# EAGLE design RPI-Lora-Gateway-Shield (EAGLE 7.7.0)
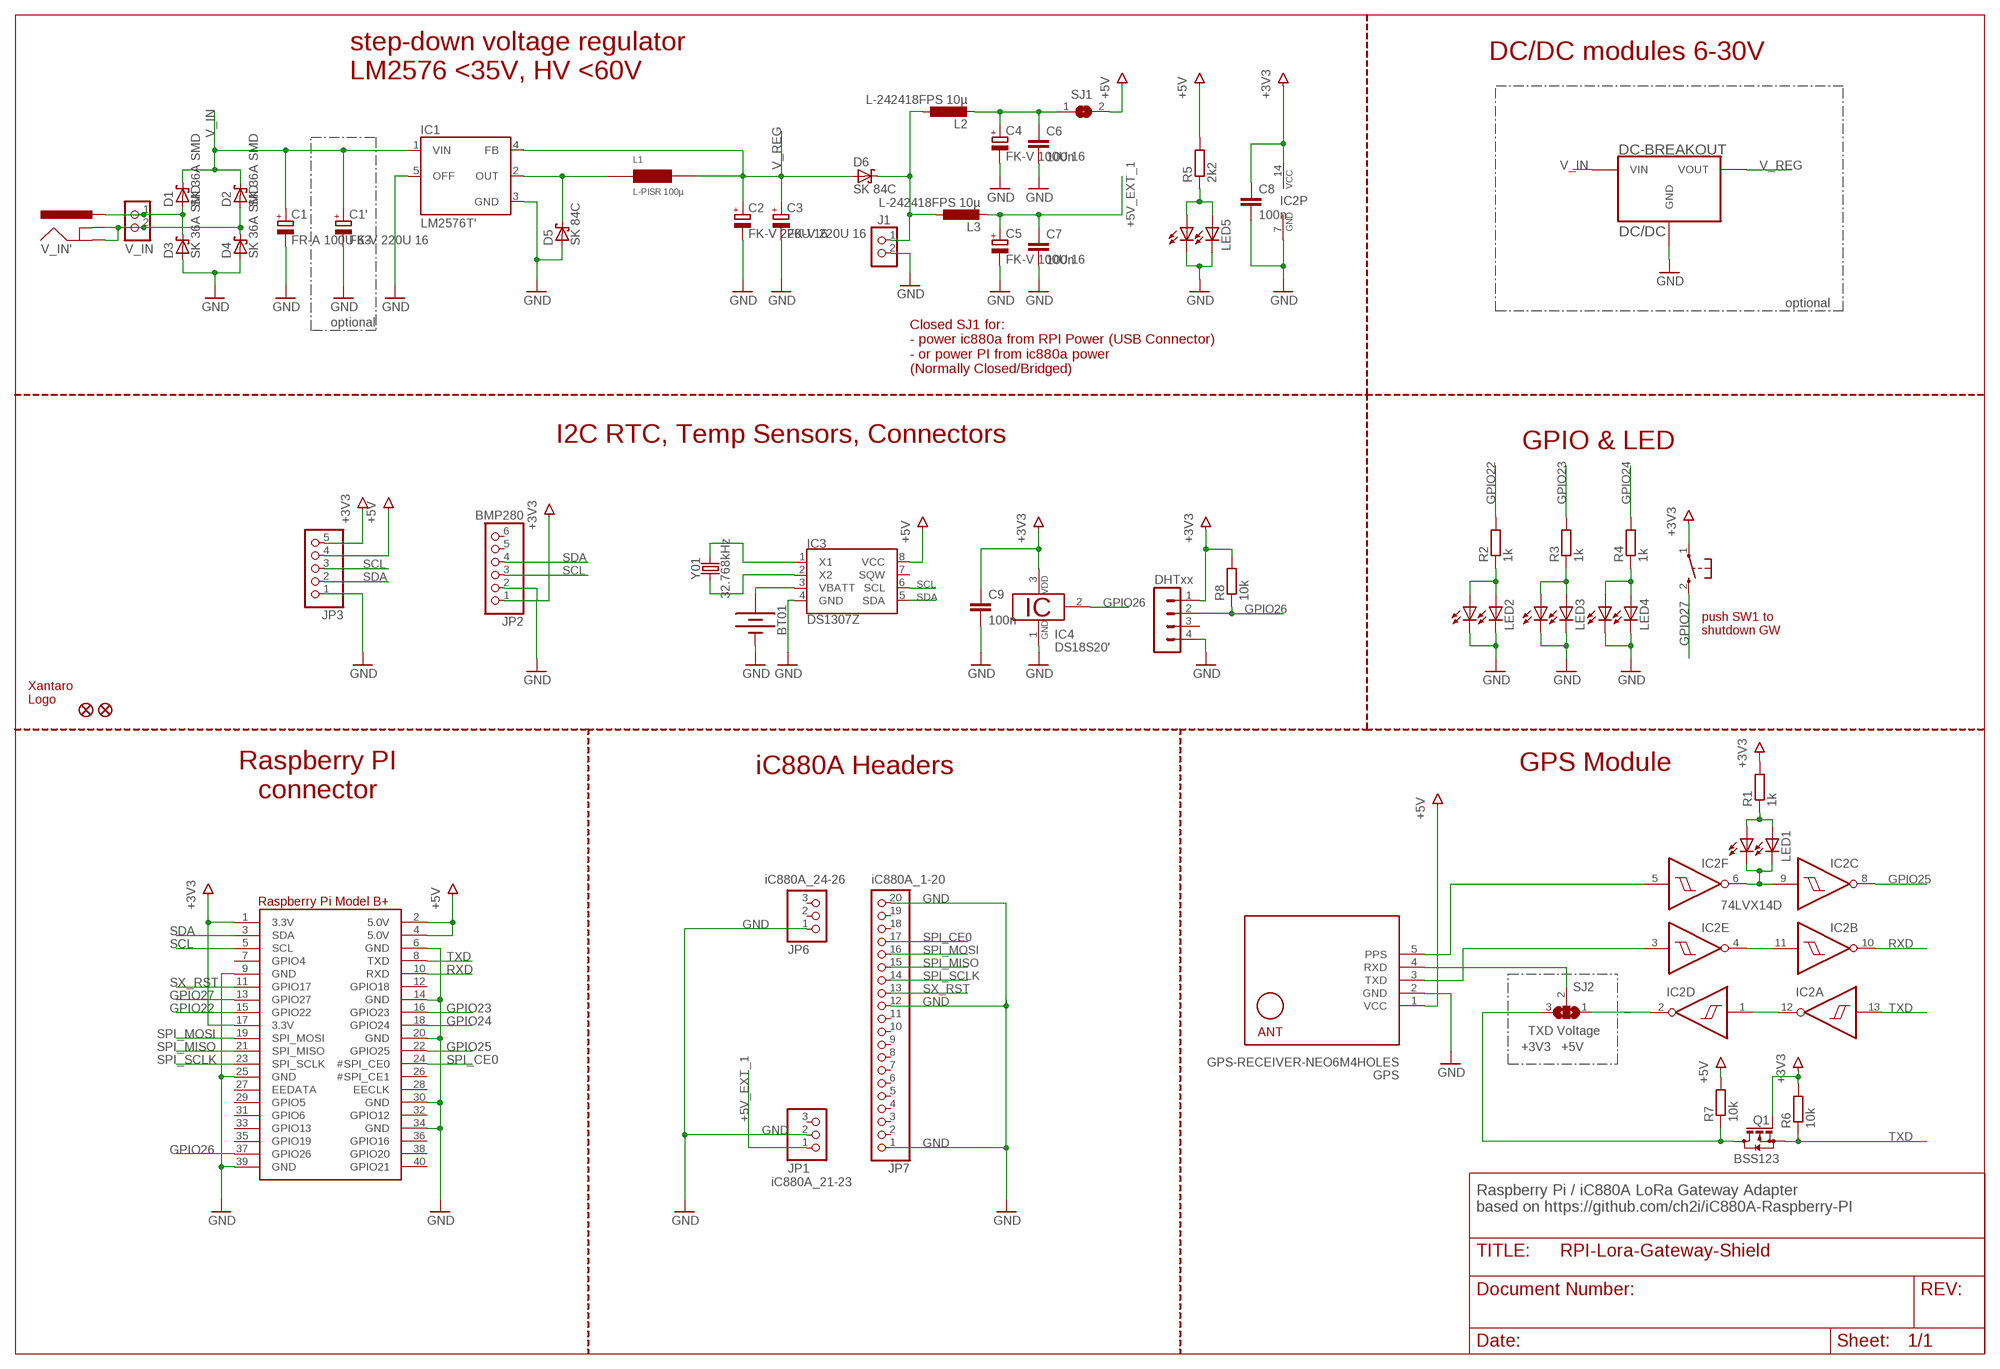
[diagram p0: schematic, sheet 1]

## Parts
BT01  BATTERY-12MM_PTH  [BATTCON_12MM_PTH]
C1  FR-A 100U 63  CPOL-EUE3.5-8  [E3,5-8]
C1'  FK-V 220U 16  CPOL-EUE  [PANASONIC_E]
C2  FK-V 220U 16  CPOL-EUE  [PANASONIC_E]
C3  FK-V 220U 16  CPOL-EUE  [PANASONIC_E]
C4  FK-V 100U 16  CPOL-EUD  [PANASONIC_D]
C5  FK-V 100U 16  CPOL-EUD  [PANASONIC_D]
C6  100n  C-EUC0805  [C0805]
C7  100n  C-EUC0805  [C0805]
C8  100n  C-EUC0805  [C0805]
C9  100n  C-EUC0805  [C0805]
D1  SK 36A SMD  SCHOTTKY-DIODESMD  [SMB]
D2  SK 36A SMD  SCHOTTKY-DIODESMD  [SMB]
D3  SK 36A SMD  SCHOTTKY-DIODESMD  [SMB]
D4  SK 36A SMD  SCHOTTKY-DIODESMD  [SMB]
D5  SK 84C  SCHOTTKY-DIODESMC  [SMC]
D6  SK 84C  SCHOTTKY-DIODESMC  [SMC]
DC/DC  DC-BREAKOUT  DC-BREAKOUTSTD  [DC-BREAKOUT]
FID2  FIDUCIAL""  [FIDUCIAL_1MM]
FID3  FIDUCIAL""  [FIDUCIAL_1MM]
GPS  GPS-RECEIVER-NEO6M4HOLES  [GPS-RECEIVER-NEO6M_4HOLES]
IC1  LM2576T'  [TO220-5_90]
IC2  74LVX14D  7414D  [SO14]
IC3  DS1307Z  [SO08-0.15]
IC4  DS18S20'  [TO92-2]
J1  +5V_IN  CON_TERMINAL_BLOCK_02-5MM  [TERMINAL_BLOCK_2P_5]
J5  DHTxx  CON_HEADER_1X04'NO_LOCK'  [1X04_NO_LOCK]
JP1  iC880A_21-23  PINHD-1X3  [1X03]
JP2  BMP280  PINHD-1X6  [1X06]
JP3  PINHD-1X5  [1X05]
JP6  iC880A_24-26  PINHD-1X3  [1X03]
JP7  iC880A_1-20  PINHD-1X20  [1X20]
L1  L-PISR 100µ  PISR  [PISR]
L2  L-242418FPS 10µ  L-EUL5650M  [L5650M]
L3  L-242418FPS 10µ  L-EUL5650M  [L5650M]
LED1  LEDCHIPLED_0805  [CHIPLED_0805]
LED1'  LED3MM  [LED3MM]
LED2  LEDCHIPLED_0805  [CHIPLED_0805]
LED2'  LED3MM  [LED3MM]
LED3  LEDCHIPLED_0805  [CHIPLED_0805]
LED3'  LED3MM  [LED3MM]
LED4  LEDCHIPLED_0805  [CHIPLED_0805]
LED4'  LED3MM  [LED3MM]
LED5  LEDCHIPLED_0805  [CHIPLED_0805]
LED5'  LED3MM  [LED3MM]
Q1  BSS123  [SOT23]
R1  1k  R-EU_R0805  [R0805]
R2  1k  R-EU_R0805  [R0805]
R3  1k  R-EU_R0805  [R0805]
R4  1k  R-EU_R0805  [R0805]
R5  2k2  R-EU_R0805  [R0805]
R6  10k  R-EU_R0805  [R0805]
R7  10k  R-EU_R0805  [R0805]
R8  10k  R-EU_R0805  [R0805]
RPI1  RASPBERRYPI_BPLUS_IDC  [2X20]
SJ1  SJCLOSED  [SJ_CLOSED]
SJ2  TXD Voltage  SJ2W  [SJ_2]
SW1'  RESET  KSS-2EG4430  [KSS-2EG4430]
U$4  XAN_LOGO_FULL_SILK_L  [XAN_FULL_SILK_L]
V_IN  V_IN  CON_TERMINAL_BLOCK_02-5MM  [TERMINAL_BLOCK_2P_5]
V_IN'  POWER_JACKPTH  [POWER_JACK_PTH]
Y01  32.768kHz  CRYSTAL-32.768KHZSMD-2X6  [CRYSTAL-SMD-2X6-CYL]

## Nets
+3V3: C8.1 C9.1 IC2.14(P:VCC) IC4.3 J5.1 JP2.1 JP3.5 Q1.1(G) R1.2 R6.2 R8.2 RPI1.1(3.3V) RPI1.17(3.3V) SW1'.1(P)
+5V: GPS.1(VCC) IC3.8(VCC) JP3.4 R5.2 R7.2 RPI1.2(5.0V) RPI1.4(5.0V) SJ1.2
+5V_EXT_1: C5.+ C7.1 JP1.1 L3.2
+5V_EXT_2: C4.+ C6.1 L2.2 SJ1.1
GND: BT01.2(-) C1'.- C1.- C2.- C3.- C4.- C5.- C6.2 C7.2 C8.2 C9.2 D3.A D4.A D5.A DC/DC.GND-1(GND) DC/DC.GND-2(GND) DC/DC.GND-3(GND) DC/DC.GND-4(GND) GPS.2(GND) IC1.3(GND) IC1.5(OFF) IC2.7(P:GND) IC3.4(GND) IC4.1 J1.2 J5.4 JP1.2 JP2.2 JP3.1 JP6.1 JP7.1 JP7.12 JP7.20 LED2'.K(C) LED2.C LED3'.K(C) LED3.C LED4'.K(C) LED4.C LED5'.K(C) LED5.C RPI1.6(GND) RPI1.9(GND) RPI1.14(GND) RPI1.20(GND) RPI1.25(GND) RPI1.30(GND) RPI1.34(GND) RPI1.39(GND)
GPIO22: R2.2 RPI1.15(GPIO22)
GPIO23: R3.2 RPI1.16(GPIO23)
GPIO24: R4.2 RPI1.18(GPIO24)
GPIO25: IC2.8(C:O) RPI1.22(GPIO25)
GPIO26: IC4.2 J5.2 R8.1 RPI1.37(GPIO26)
GPIO27: RPI1.13(GPIO27) SW1'.2(S)
N$14: D1.A D3.C V_IN'.PWR V_IN.1
N$16: LED1'.A LED1.A R1.1
N$18: IC2.1(D:I) IC2.12(A:O)
N$27: D6.C J1.1 L2.1 L3.1
N$28: D2.A D4.C V_IN'.GND V_IN'.GNDBREAK V_IN.2
N$29: GPS.5(PPS) IC2.5(F:I)
N$30: IC2.6(F:O) IC2.9(C:I) LED1'.K(C) LED1.C
N$31: GPS.3(TXD) IC2.3(E:I)
N$32: IC2.4(E:O) IC2.11(B:I)
N$34: GPS.4(RXD) SJ2.2
N$35: IC2.2(D:O) SJ2.1
N$36: D5.C IC1.2(OUT) L1.1
N$37: BT01.1(+) IC3.3(VBATT)
N$38: IC3.2(X2) Y01.X1
N$39: IC3.1(X1) Y01.X2
N$40: LED5'.A LED5.A R5.1
N$41: LED3'.A LED3.A R3.1
N$43: LED4'.A LED4.A R4.1
N$44: Q1.3(D) R7.1 SJ2.3
N$45: LED2'.A LED2.A R2.1
RXD: IC2.10(B:O) RPI1.10(RXD)
SCL: IC3.6(SCL) JP2.3 JP3.3 RPI1.5(SCL)
SDA: IC3.5(SDA) JP2.4 JP3.2 RPI1.3(SDA)
SPI_CE0: JP7.17 RPI1.24(#SPI_CE0)
SPI_MISO: JP7.15 RPI1.21(SPI_MISO)
SPI_MOSI: JP7.16 RPI1.19(SPI_MOSI)
SPI_SCLK: JP7.14 RPI1.23(SPI_SCLK)
SX_RST: JP7.13 RPI1.11(GPIO17)
TXD: IC2.13(A:I) Q1.2(S) R6.1 RPI1.8(TXD)
V_IN: C1'.+ C1.+ D1.C D2.C DC/DC.VIN-1(VIN) DC/DC.VIN-2(VIN) IC1.1(VIN)
V_REG: C2.+ C3.+ D6.A DC/DC.VOUT-1(VOUT) DC/DC.VOUT-2(VOUT) IC1.4(FB) L1.2
Unconnected: IC3.7(SQW) J5.3 JP1.3 JP2.5 JP2.6 JP6.2 JP6.3 JP7.2 JP7.3 JP7.4 JP7.5 JP7.6 JP7.7 JP7.8 JP7.9 JP7.10 JP7.11 JP7.18 JP7.19 RPI1.7(GPIO4) RPI1.12(GPIO18) RPI1.26(#SPI_CE1) RPI1.27(EEDATA) RPI1.28(EECLK) RPI1.29(GPIO5) RPI1.31(GPIO6) RPI1.32(GPIO12) RPI1.33(GPIO13) RPI1.35(GPIO19) RPI1.36(GPIO16) RPI1.38(GPIO20) RPI1.40(GPIO21)

## Notes on the sheet
- DC/DC modules 6-30V
- step-down voltage regulator
  LM2576 <35V, HV <60V
- optional
- optional
- Closed SJ1 for:
  - power ic880a from RPI Power (USB Connector)
  - or power PI from ic880a power
  (Normally Closed/Bridged)
- I2C RTC, Temp Sensors, Connectors | GPIO & LED
- push SW1 to
  shutdown GW
- GPS Module
- Raspberry PI
  connector
- iC880A Headers
- +3V3   +5V
- Raspberry Pi / iC880A LoRa Gateway Adapter
  based on https://github.com/ch2i/iC880A-Raspberry-PI

## Library data of the parts
BT01 = SparkFun-Batteries:BATTERY: Battery - Single Cell A variety of battery chemistries, sizes, and footprints. Device List: 20MM_PTH - Coin Cell Battery Holder - 20mm (PTH) <https://www.sparkfun.com/products/783> 12MM_SMD - Coin Cell Battery Holder - 12mm (SMD) <https://www.sparkfun.com/products/10592> 12MM_PTH - Coin Cell Battery Holder - 12mm (PTH) <https://www.sparkfun.com/products/7948> 20MM_SMD - 20mm Coin Cell Battery Holder (SMD) (2 legs) Used on the Big Time Watch Kit <https://www.sparkfun.com/products/11734> 20MM_SMD_4LEGS - Coin Cell Battery Holder - 20mm (SMD) <https://www.sparkfun.com/products/11892> 20MM_SMD_4LEGS_OVERPASTE - Coin Cell Battery Holder - 20mm (SMD) <https://www.sparkfun.com/products/11892> (Over-paste on the legs) 24.5MM_PTH - Coin Cell Battery Holder - 24.5mm (PTH) <https://www.sparkfun.com/products/8863> 9V - 9V Battery Holder - PC Mount Used on the SparkFun SparkPunk Sound Kit <https://www.sparkfun.com/products/11177> and SparkFun SparkPunk Sequencer Kit <https://www.sparkfun.com/products/12707> 18650 - Battery Holder - 18650 (PTH) <https://www.sparkfun.com/products/13113> AA - Battery Holder - 1xAA (PTH) <https://www.sparkfun.com/products/7949> AAA - Battery Holder - 1xAAA (PTH) <https://www.sparkfun.com/products/12718> AA_KIT - Battery Holder - 1xAA (PTH) <https://www.sparkfun.com/products/7949> Special kit package - pads only have exposed copper on one side of the board. AAA_KIT - Battery Holder - 1xAAA (PTH) <https://www.sparkfun.com/products/12718> Special kit package - pads only have exposed copper on one side of the board.
C1 C1' C2-C5 = rcl:CPOL-EU: POLARIZED CAPACITOR, European symbol
C6-C9 = rcl:C-EU: CAPACITOR, European symbol
D1-D6 = diode:SCHOTTKY-DIODE: Schottky Diode
DC/DC = _c2h:DC-BREAKOUT
FID2 FID3 = microbuilder:FIDUCIAL: Fiducial Alignment Points Various fiducial points for machine vision alignment.; BOM: EXCLUDE
GPS = diy-modules:GPS-RECEIVER-NEO6M: GPS Receiver Module based on NEO-6 device Short tutorial how to use NEO-6 module with Arduino: http://www.xarg.org/2016/06/neo6mv2-gps-module-with-arduino/ NEO-6 datasheet is available here: https://www.u-blox.com/sites/default/files/products/documents/NEO-6_DataSheet_%28GPS.G6-HW-09005%29.pdf Click here to find device on ebay.com <http://www.ebay.com/sch/gyneo6mv2>
IC1 = v-reg-3:LM2576: National Semiconductor <http://www.national.com> 3.0A "Simple Switcher"(c) 52kHz, Vout 1.23-37V (HV: 57V), Vin 40V (HV: 60V), 50µA standby current
IC2 = 74xx-eu:74*14: Hex schmitt trigger INVERTER
IC3 = SparkFun-Clocks:DS1307: Maxim DS1307 - I2C Real-time clock (RTC) The DS1307 serial real-time clock (RTC) is a low-power, full binary-coded decimal (BCD) clock/calendar plus 56 bytes of NV SRAM. Address and data are transferred serially through an I2C, bidirectional bus. The clock/calendar provides seconds, minutes, hours, day, date, month, and year information. SparkFun Products: Real Time Clock Module <https://www.sparkfun.com/products/12708> (BOB-12708) Datasheet <https://cdn.sparkfun.com/datasheets/BreakoutBoards/DS1307.pdf>; PROD_ID: IC-08138
IC4 = 1wire:DS18S20: High Precision Digital Thermometer This chip provides a onewire thermosensor with approx. 0.5°C accuracy.A programmable over/undertemperure alarm is available. Notes: Vdd must be applied for accurate measurements at low temperatures, as the parasite power circuit otherwise heats the sensor. If parasite power is used, Vdd has to be connected to GND. The DS1822 is a low-cost thermometer chip, the DS18B20 is similar to the DS18S20, but with 9..12 Bit programmable precision. Author: Jan Kandziora <jjj@gmx.de>
J1 V_IN = dp_devices:CON_TERMINAL_BLOCK_02: 2 poles wire to board terminal block
J5 = _c2h:CON_HEADER_1X04
JP1 JP6 = pinheader:PINHD-1X3: PIN HEADER
JP2 = pinheader:PINHD-1X6: PIN HEADER
JP3 = pinheader:PINHD-1X5: PIN HEADER
JP7 = pinheader:PINHD-1X20: PIN HEADER
L1 = inductor_FASTRON:PISR
L2 L3 = resistor:L-EU: INDUCTOR, European symbol
LED1 LED1' LED2 LED2' LED3 LED3' LED4 LED4' LED5 LED5' = led:LED: LED OSRAM: - CHIPLED LG R971, LG N971, LY N971, LG Q971, LY Q971, LO R971, LY R971 LH N974, LH R974 LS Q976, LO Q976, LY Q976 LO Q996 - Hyper CHIPLED LW Q18S LB Q993, LB Q99A, LB R99A - SideLED LS A670, LO A670, LY A670, LG A670, LP A670 LB A673, LV A673, LT A673, LW A673 LH A674 LY A675 LS A676, LA A676, LO A676, LY A676, LW A676 LS A679, LY A679, LG A679 - Hyper Micro SIDELED® LS Y876, LA Y876, LO Y876, LY Y876 LT Y87S - SmartLED LW L88C, LW L88S LB L89C, LB L89S, LG L890 LS L89K, LO L89K, LY L89K LS L896, LA L896, LO L896, LY L896 - TOPLED LS T670, LO T670, LY T670, LG T670, LP T670 LSG T670, LSP T670, LSY T670, LOP T670, LYG T670 LG T671, LOG T671, LSG T671 LB T673, LV T673, LT T673, LW T673 LH T674 LS T676, LA T676, LO T676, LY T676, LB T676, LH T676, LSB T676, LW T676 LB T67C, LV T67C, LT T67C, LS T67K, LO T67K, LY T67K, LW E67C LS E67B, LA E67B, LO E67B, LY E67B, LB E67C, LV E67C, LT E67C LW T67C LS T679, LY T679, LG T679 LS T770, LO T770, LY T770, LG T770, LP T770 LB T773, LV T773, LT T773, LW T773 LH T774 LS E675, LA E675, LY E675, LS T675 LS T776, LA T776, LO T776, LY T776, LB T776 LHGB T686 LT T68C, LB T68C - Hyper Mini TOPLED® LB M676 - Mini TOPLED Santana® LG M470 LS M47K, LO M47K, LY M47K Source: http://www.osram.convergy.de LUXEON: - LUMILED® LXK2-PW12-R00, LXK2-PW12-S00, LXK2-PW14-U00, LXK2-PW14-V00 LXK2-PM12-R00, LXK2-PM12-S00, LXK2-PM14-U00 LXK2-PE12-Q00, LXK2-PE12-R00, LXK2-PE12-S00, LXK2-PE14-T00, LXK2-PE14-U00 LXK2-PB12-K00, LXK2-PB12-L00, LXK2-PB12-M00, LXK2-PB14-N00, LXK2-PB14-P00, LXK2-PB14-Q00 LXK2-PR12-L00, LXK2-PR12-M00, LXK2-PR14-Q00, LXK2-PR14-R00 LXK2-PD12-Q00, LXK2-PD12-R00, LXK2-PD12-S00 LXK2-PH12-R00, LXK2-PH12-S00 LXK2-PL12-P00, LXK2-PL12-Q00, LXK2-PL12-R00 Source: www.luxeon.com KINGBRIGHT: KA-3528ASYC Source: www.kingbright.com
Q1 = transistor-small-signal:BSS123: N-CHANNEL MOS FET
R1-R8 = rcl:R-EU_: RESISTOR, European symbol
RPI1 = microbuilder:RASPBERRYPI_BPLUS
SJ1 = jumper:SJ: SMD solder JUMPER
SJ2 = jumper:SJ2W: SMD solder JUMPER
SW1' = buttons:KSS-2EG4430: Size: 3x6mm Height: 5mm from PCB Rating: DC12v 50mA Travel: 0.25±0.10mm Operating Force: 180±50gf Return Force: 60gf min Contact resistance: 100m? max Insulation resistance: 100M? min Operating life?50,000 cycles
U$4 = xantaro_logo:XAN_LOGO
V_IN' = SparkFun-Connectors:POWER_JACK: Power Jack This is the standard 5.5mm barrel jack for power. The PTH is the most common, proven, reliable, footprint. The Slot footprint only works if the mill layer is transmitted to the PCB fab house so be warned. Spark Fun Electronics SKU : PRT-00119 SMT: CONN-08106 Mating wall wart : TOL-00298 (and others)
Y01 = SparkFun-Clocks:CRYSTAL-32.768KHZ: 32.768kHz Crystal Frequency: 32.768kHz Frequency Stability: ±20ppm Load Capacitance: 12.5pF (PTH-2X6 & SMD-3.2X1.5), 6pF (SMD-2X6) SparkFun Products: SparkFun BigTime Watch Kit <https://www.sparkfun.com/products/11734> SparkFun nRF52832 Breakout <https://www.sparkfun.com/products/13990> SparkFun Real Time Clock Module <https://www.sparkfun.com/products/12708>; PROD_ID: XTAL-07894

## Board
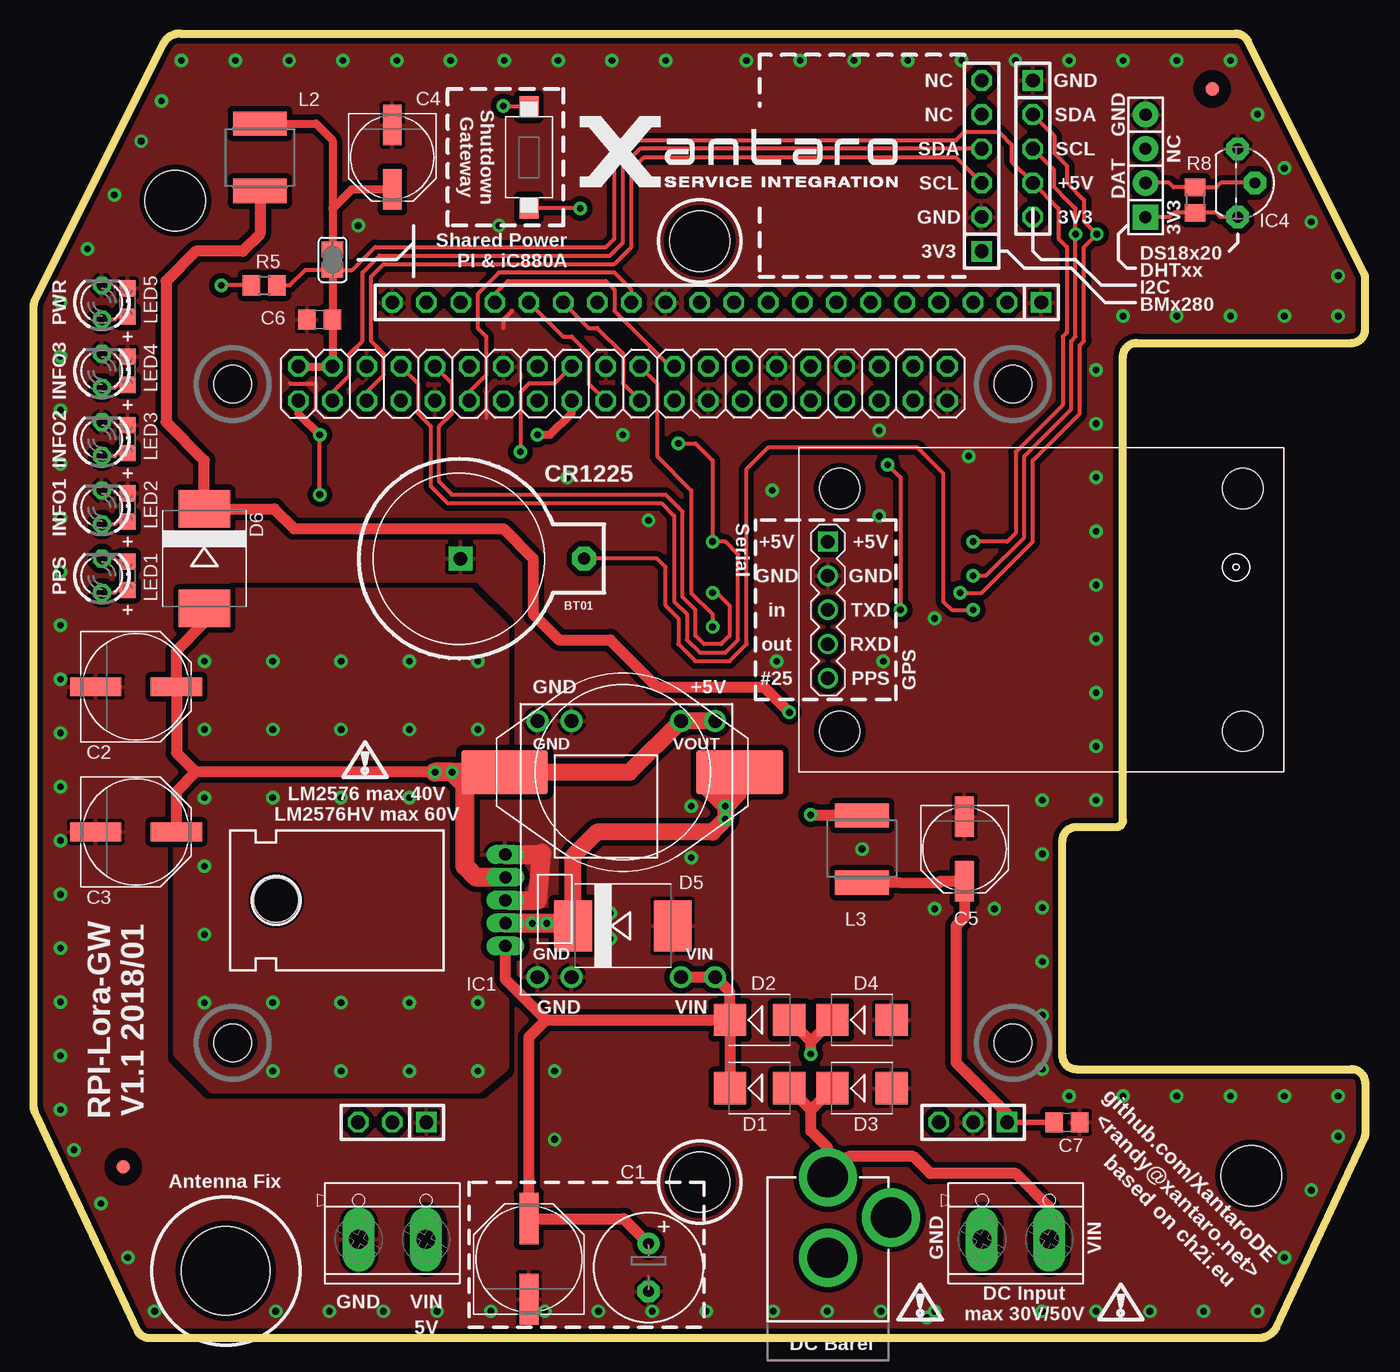
[diagram p1: board, top side]
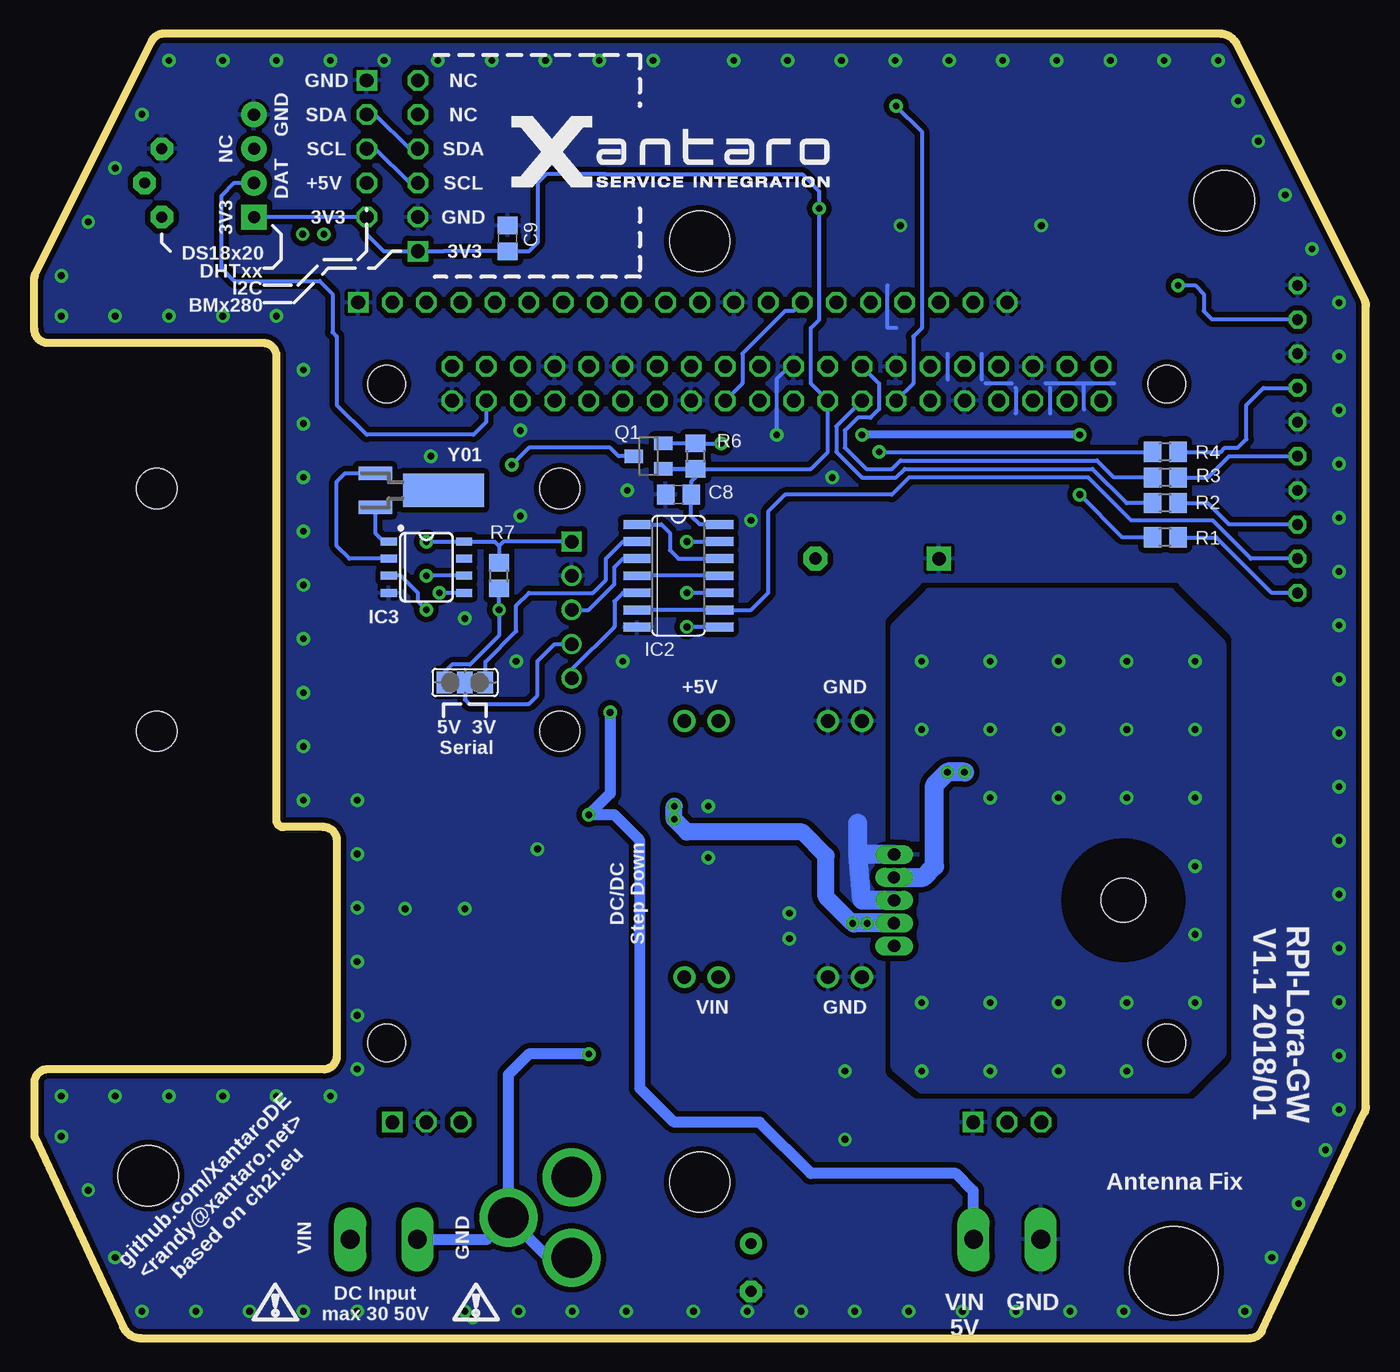
[diagram p2: board, bottom side, seen from below]

Size 99.06 x 97 mm. Coordinates in mm from the lower left corner, seen from the top.
Outline: 99.06,75.11 arc-90 97.79,73.83
Outline: 0.11,77.21 arc27 0,76.76
Outline: 99,15.12 arc-27 98.95,14.89
Outline: 92.42,0.83 arc-63 91.07,0
Outline: 8.62,0 arc-63 7.72,0.55
Outline: 0.11,16.79 arc-27 0,17.24
Outline: 89.38,97 arc-63 90.28,96.45
Outline: 99,78.88 arc27 98.95,79.11
Outline: 10.87,97 arc63 9.61,96.22
Outline: 98,20 arc-90 99,19
Outline: 77.5,20 arc-90 76.5,21
Outline: 76.5,37 arc-90 77.5,38
Outline: 80.5,38 arc90 81,38.5
Outline: 81,73 arc-90 82,74
Outline: 98,74 arc90 99,75
Outline: 99.06,75.11 arc-90 97.79,73.83
Outline: 0.11,77.21 arc27 0,76.76
Outline: 99,15.12 arc-27 98.95,14.89
Outline: 92.42,0.83 arc-63 91.07,0
Outline: 8.62,0 arc-63 7.72,0.55
Outline: 0.11,16.79 arc-27 0,17.24
Outline: 89.38,97 arc-63 90.28,96.45
Outline: 99,78.88 arc27 98.95,79.11
Outline: 10.87,97 arc63 9.61,96.22
Outline: 98,20 arc-90 99,19
Outline: 77.5,20 arc-90 76.5,21
Outline: 76.5,37 arc-90 77.5,38
Outline: 80.5,38 arc90 81,38.5
Outline: 81,73 arc-90 82,74
Outline: 98,74 arc90 99,75
Outline: 99.06,75.11 arc-90 97.79,73.83
Outline: 0.11,77.21 arc27 0,76.76
Outline: 99,15.12 arc-27 98.95,14.89
Outline: 92.42,0.83 arc-63 91.07,0
Outline: 8.62,0 arc-63 7.72,0.55
Outline: 0.11,16.79 arc-27 0,17.24
Outline: 89.38,97 arc-63 90.28,96.45
Outline: 99,78.88 arc27 98.95,79.11
Outline: 10.87,97 arc63 9.61,96.22
Outline: 98,20 arc-90 99,19
Outline: 77.5,20 arc-90 76.5,21
Outline: 76.5,37 arc-90 77.5,38
Outline: 80.5,38 arc90 81,38.5
Outline: 81,73 arc-90 82,74
Outline: 98,74 arc90 99,75
Outline: 99.06,75.11 arc-90 97.79,73.83
Outline: 9.61,96.22 0.11,77.21
Outline: 0.11,77.21 arc27 0,76.76
Outline: 99,19 99,15.12
Outline: 99,15.12 arc-27 98.95,14.89
Outline: 98.95,14.89 92.42,0.83
Outline: 92.42,0.83 arc-63 91.07,0
Outline: 91.07,0 8.62,0
Outline: 8.62,0 arc-63 7.72,0.55
Outline: 7.72,0.55 0.11,16.79
Outline: 0.11,16.79 arc-27 0,17.24
Outline: 0,17.24 0,76.76
Outline: 10.87,97 89.38,97
Outline: 89.38,97 arc-63 90.28,96.45
Outline: 99,75 99,78.88
Outline: 99,78.88 arc27 98.95,79.11
Outline: 98.95,79.11 90.28,96.45
Outline: 10.87,97 arc63 9.61,96.22
Outline: 77.5,20 98,20
Outline: 98,20 arc-90 99,19
Outline: 77.5,20 arc-90 76.5,21
Outline: 76.5,21 76.5,37
Outline: 76.5,37 arc-90 77.5,38
Outline: 77.5,38 80.5,38
Outline: 80.5,38 arc90 81,38.5
Outline: 81,38.5 81,73
Outline: 81,73 arc-90 82,74
Outline: 82,74 98,74
Outline: 98,74 arc90 99,75
Copper layers (1*16): Top 0.035mm / dielectric 1.5mm / Bottom 0.035mm
Design rules "Elecrow_2-layer_eagle_rule *": minimum track width 6mil, minimum drill 12mil, track to track 6mil, track to pad 6mil, pad to pad 6mil, via to via 6mil, smd to smd 0mil, copper to edge 10mil, drill to drill 10mil, minimum pad ring 10mil, minimum via ring 6mil, stop-mask expansion 2mil, vias tented up to drill 100mil, thermal gap 10mil
Holes 6.6 mm at 14.29,5
Holes 4.5 mm at 49.53,11.61 49.53,81.58 10.53,84.58 90.53,12.08
Holes 2.8 mm at 14.8,70.95 72.8,70.95 72.8,21.95 14.8,21.95

### Footprints (pad centres in the part's own frame; a part is rotated, then mirrored left to right if it is on the bottom)
BATTCON_12MM_PTH = drill 0.9 pad 1.778 octagon: 1 9.19,0 | drill 1 pad 1.778 square: 2 -0.015,0
E3,5-8 = drill 0.813 pad 1.6: + -1.778,0 | drill 0.813 pad 1.6 octagon: - 1.778,0
PANASONIC_E = smd 3.8 x 1.4: + 3,0; - -3,0
PANASONIC_D = smd 3 x 1.4: + 2.4,0; - -2.4,0
C0805 = smd 1.3 x 1.5: 1 -0.95,0; 2 0.95,0
SMB = smd 2.4 x 2.4: A 2.2,0; C -2.2,0
SMC = smd 2.8 x 3.8: A 3.7,0; C -3.7,0
DC-BREAKOUT = drill 1.02 pad 1.632: GND-1 -10.16,6.35; GND-2 -10.16,3.81; GND-3 8.89,6.35; GND-4 8.89,3.81; VIN-1 -10.16,-4.318; VIN-2 -10.16,-6.858; VOUT-1 8.89,-4.318; VOUT-2 8.89,-6.858
FIDUCIAL_1MM = smd 1 x 1: 1 0,0
GPS-RECEIVER-NEO6M_4HOLES = drill 1 square: 1 -15.875,5.08 | drill 1: 2 -15.875,2.54; 3 -15.875,0; 4 -15.875,-2.54; 5 -15.875,-5.08 | hole 3: -14.986,9.017; -14.986,-9.017; 14.986,-9.017; 14.986,9.017
TO220-5_90 = drill 0.9 pad 1.27 long: 1 -3.4,-9.035; 2 -1.7,-9.045; 3 0,-9.035; 4 1.7,-9.045; 5 3.4,-9.035 | hole 3.302: 0,8.001
SO14 = smd 0.66 x 2.032: 1 -3.81,-3.073; 2 -2.54,-3.073; 3 -1.27,-3.073; 4 0,-3.073; 5 1.27,-3.073; 6 2.54,-3.073; 7 3.81,-3.073; 8 3.81,3.073; 9 2.54,3.073; 10 1.27,3.073; 11 0,3.073; 12 -1.27,3.073; 13 -2.54,3.073; 14 -3.81,3.073
SO08-0.15 = smd 0.6 x 1.2: 1 -1.905,-2.8; 2 -0.635,-2.8; 3 0.635,-2.8; 4 1.905,-2.8; 5 1.905,2.8; 6 0.635,2.8; 7 -0.635,2.8; 8 -1.905,2.8
TO92-2 = drill 0.813 pad 1.676 octagon: 1 -2.54,0; 2 0,1.27; 3 2.54,0
TERMINAL_BLOCK_2P_5 = drill 1.4 pad 2.38 long: 1 2.5,-0.45; 2 -2.5,-0.45
1X04_NO_LOCK = drill 0.9 pad 1.88 square: 1 -3.816,-0.121 | drill 0.9 pad 1.88: 2 -1.27,-0.133; 3 1.27,-0.121; 4 3.81,-0.133
1X03 = drill 1.016 square: 1 -2.54,0 | drill 1.016 octagon: 2 0,0; 3 2.54,0
1X06 = drill 1.016 square: 1 -6.35,0 | drill 1.016 octagon: 2 -3.81,0; 3 -1.27,0; 4 1.27,0; 5 3.81,0; 6 6.35,0
1X05 = drill 1.016 square: 1 -5.08,0 | drill 1.016 octagon: 2 -2.54,0; 3 0,0; 4 2.54,0; 5 5.08,0
1X20 = drill 1.016 square: 1 -24.13,0 | drill 1.016 octagon: 2 -21.59,0; 3 -19.05,0; 4 -16.51,0; 5 -13.97,0; 6 -11.43,0; 7 -8.89,0; 8 -6.35,0; 9 -3.81,0; 10 -1.27,0; 11 1.27,0; 12 3.81,0; 13 6.35,0; 14 8.89,0; 15 11.43,0; 16 13.97,0; 17 16.51,0; 18 19.05,0; 19 21.59,0; 20 24.13,0
PISR = smd 6.452 x 3.251: 1 -8.7,0; 2 8.8,0
L5650M = smd 1.8 x 4: 1 -2.5,0; 2 2.5,0
CHIPLED_0805 = smd 1.2 x 1.2: A 0,-1.05; C 0,1.05
LED3MM = drill 0.813 octagon: A -1.27,0; K 1.27,0
SOT23 = smd 1 x 1.4: 1 -0.95,-1.1; 2 0.95,-1.1; 3 0,1.1
R0805 = smd 1.3 x 1.5: 1 -0.95,0; 2 0.95,0
2X20 = drill 1.016 octagon: 1 -24.13,-1.27; 2 -24.13,1.27; 3 -21.59,-1.27; 4 -21.59,1.27; 5 -19.05,-1.27; 6 -19.05,1.27; 7 -16.51,-1.27; 8 -16.51,1.27; 9 -13.97,-1.27; 10 -13.97,1.27; 11 -11.43,-1.27; 12 -11.43,1.27; 13 -8.89,-1.27; 14 -8.89,1.27; 15 -6.35,-1.27; 16 -6.35,1.27; 17 -3.81,-1.27; 18 -3.81,1.27; 19 -1.27,-1.27; 20 -1.27,1.27; 21 1.27,-1.27; 22 1.27,1.27; 23 3.81,-1.27; 24 3.81,1.27; 25 6.35,-1.27; 26 6.35,1.27; 27 8.89,-1.27; 28 8.89,1.27; 29 11.43,-1.27; 30 11.43,1.27; 31 13.97,-1.27; 32 13.97,1.27; 33 16.51,-1.27; 34 16.51,1.27; 35 19.05,-1.27; 36 19.05,1.27; 37 21.59,-1.27; 38 21.59,1.27; 39 24.13,-1.27; 40 24.13,1.27
SJ_CLOSED = smd 1.168 x 1.6: 1 -0.762,0; 2 0.762,0
SJ_2 = smd 1.168 x 1.6: 1 -1.524,0; 2 0,0; 3 1.524,0
KSS-2EG4430 = smd 1.6 x 1.4: 1 -3.75,0; 2 3.75,0
POWER_JACK_PTH = drill 2.997 pad 4.318: GND 0,7.7; GNDBREAK 4.7,10.7; PWR 0,13.7
CRYSTAL-SMD-2X6-CYL = smd 2.5 x 6: SHEILD 0,5.08 | smd 1 x 2.5: X1 -1.27,0; X2 1.27,0

### Placement (x,y rotation side)
BT01  31.75,57.96 0 top
C1  45.72,5.26 270 top
C1'  36.83,5.89 90 top
C2  7.62,48.44 0 top
C3  7.62,37.64 0 top
C4  26.67,87.81 270 top
C5  69.22,36.37 270 top
C6  21.27,75.74 180 top
C7  76.83,16.05 0 top
C8  51.12,62.72 180 bottom
C9  63.82,81.77 90 bottom
D1  53.98,18.59 0 top
D2  53.98,23.67 0 top
D3  61.59,18.59 0 top
D4  61.59,23.67 0 top
D5  43.81,30.66 0 top
D6  12.7,57.96 270 top
DC/DC  43.81,37.01 90 top
FID2  6.67,12.73 0 top
FID3  87.63,92.89 0 top
GPS  74.93,54.15 0 top
IC1  26.04,32.56 90 top
IC2  51.12,56.69 270 bottom
IC3  69.85,57.33 270 bottom
IC4  89.53,85.9 270 top
J1  26.67,7.79 0 top
J5  82.55,87.17 90 top
JP1  69.85,16.05 180 top
JP2  70.48,87.17 90 top
JP3  74.3,88.44 270 top
JP6  26.67,16.05 180 top
JP7  50.8,77.01 180 top
L1  43.81,42.09 180 top
L2  16.83,87.81 90 top
L3  61.59,36.37 270 top
LED1  6.99,56.69 0 top
LED1'  5.08,56.69 90 top
LED2  6.99,61.77 0 top
LED2'  5.08,61.77 90 top
LED3  6.99,66.85 0 top
LED3'  5.08,66.85 90 top
LED4  6.99,71.93 0 top
LED4'  5.08,71.93 90 top
LED5  6.99,77.01 0 top
LED5'  5.08,77.01 90 top
Q1  53.34,65.58 90 bottom
R1  14.92,59.55 180 bottom
R2  14.92,62.09 180 bottom
R3  14.92,63.99 180 bottom
R4  14.92,65.9 180 bottom
R5  17.14,78.28 0 top
R6  49.85,65.58 270 bottom
R7  64.45,56.69 90 bottom
R8  86.36,84.63 270 top
RPI1  43.81,70.98 0 top
SJ1  22.23,80.19 270 top
SJ2  66.99,48.75 180 bottom
SW1'  36.83,87.81 90 top
U$4  40.64,85.58 0 top
U$5  XAN_LOGO_FULL_SILK_L  [XAN_FULL_SILK_L]  63.5,85.58 0 bottom
V_IN  73.03,7.79 0 top
V_IN'  59.05,-1.73 0 top
Y01  73.66,63.04 270 bottom

### Tracks (layer width: path | path; a pad name or v marks a point on that pad's centre or on a via)
+3V3  (via drill 0.5 pad 1)
  Top 0.305: IC4.3 88.27,83.36 87.95,83.68 R8.2 84.78,83.68 84.45,83.36 J5.1 | v21.27,62.72 v21.27,67.17 | SW1'.1 40.58,84.06 v40.64,84
  Top 0.61: RPI1.1 19.68,68.75 v21.27,67.17 | v37.47,67.17 38.42,67.17 40.01,68.75 RPI1.17
  Bottom 0.305: IC2.14 49.53,60.5 50.16,61.14 C8.1 50.16,63.67 49.85,63.99 R6.2 | R1.2 18.1,59.55 v21.27,62.72 | 52.7,64.62 R6.2 | R6.2 Q1.1 | R6.2 41.27,64.63 40.01,65.9 RPI1.17 41.27,70.98 41.27,75.11 40.64,75.74 v40.64,84 40.64,85.27 41.91,86.53 56.52,86.53 60.96,86.53 61.59,85.9 61.59,81.45 62.23,80.82 C9.1 67.31,80.82 67.63,80.82 68.58,80.82 JP2.1 73.03,80.82 74.3,82.09 JP3.5 J5.1
  Bottom 0.61: v21.27,67.17 v37.47,67.17
+5V  (via drill 0.5 pad 1)
  Top 0.305: v69.85,59.23 72.39,59.23 73.03,59.87 73.03,65.9 76.52,69.39 76.52,74.47 76.83,74.79 76.83,81.14 76.2,81.77 76.2,84 JP3.4 72.71,87.49 72.71,88.76 71.75,89.71 69.22,89.71 68.58,89.08 44.77,89.08 43.18,87.49 43.18,81.77 42.55,81.14 25.4,81.14 23.69,79.42 SJ1.2 20.19,79.42 19.05,78.28 R5.2
  Top 0.61: RPI1.2 RPI1.4 SJ1.2
  Bottom 0.305: v69.85,59.23 IC3.8 64.77,59.23 64.45,58.91 | GPS.1 64.14,59.23 64.45,58.91 | 64.45,58.91 R7.2
+5V_EXT_1
  Top 0.406: JP1.1 C7.1
  Top 0.813: L3.2 67.31,33.83 67.45,33.97 C5.+ 69.22,31.29 68.58,30.66 68.58,20.5 72.39,16.68 JP1.1
+5V_EXT_2
  Top 0.406: C6.1 SJ1.1
  Top 0.61: L2.2 21,90.31 22.23,89.08 22.23,84 | 22.23,84 SJ1.1 | C4.+ 23.64,85.41 22.23,84
GND  (via drill 0.5 pad 1)
  Top 0.305: RPI1.20 42.86,72.25 | 34.92,75.11 34.92,75.74 35.56,76.38 | 20.95,69.07 20.95,70.98 19.05,70.98 | 33.66,70.34 33.66,68.44
  Top 1.422: 35.24,32.56 37.47,32.56 37.78,35.96 | IC1.5 37.78,35.96 | 37.78,35.96 37.78,36.05
  Bottom 0.305: RPI1.20 42.86,72.25 43.81,71.3 v43.81,67.17 | 34.92,75.11 35.56,75.11 35.56,78.28 | 28.57,73.2 28.57,71.3 | 31.11,73.2 31.11,71.3 | 26.35,70.98 28.26,70.98 | 18.73,70.98 20.95,70.98 | 20.95,70.98 23.81,70.98 | 20.95,69.07 20.95,70.98 | 23.5,70.66 23.5,68.75 | 26.04,70.66 26.04,68.75
  Bottom 1.422: IC1.5 37.78,35.96 | 37.78,35.96 37.78,38.27 | IC1.3 37.47,32.56 37.78,35.96
  other vias: 42.86,29.7 42.86,31.61 48.9,35.73 48.9,39.55 61.59,36.37 66.99,53.52 79,56 69.53,65.58 54.93,63.04 62.87,61.14 55.24,50.34 79,68 24.13,82.72 66.99,31.92 71.44,31.92 9,2 7,6 5,10 3,14 2,17 2,21 18,2 22,2 26,2 30,2 34,2 38,2 42,2 46,2 50,2 55,2 59,2 63,2 67,2 66.41,1.54 75,2 79,2 83,2 87,2 91,2 93,6 95,11 97,15 97,18 93,18 89,18 85,18 81,18 77,18 75,24 75,20 75,28 75,32 75,36 79,40 75,40 79,44 79,48 79,52 79,60 79,64 81,76 85,76 89,76 93,76 97,79 97,76 95,83 93,87 91,91 89,95 85,95 81,95 77,95 73,95 69,95 65,95 61,95 57,95 53,95 43,95 39,95 35,95 31,95 27,95 23,95 19,95 15,95 11,95 9.5,92 47,95 8,89 6,85 4,81 2,77 2,73 2,69 2,65 2,61 2,57 2,53 2,49 2,45 2,41 2,37 2,33 2,29 2,25 34.61,82.72 45.72,60.82 39.69,63.99 62.87,67.48 63.18,50.34 79,72 38.73,19.86 38.73,14.78
  pour Top (isolate 0.406, rank 6): -1.91,96.69 100.97,96.69 100.97,-4.27 -1.91,-4.27
  pour Bottom (isolate 0.406, rank 6): -3.17,97.97 101.6,98.6 102.23,-5.54 -3.17,-5.54
GPIO22
  Bottom 0.305: RPI1.15 39.37,67.8 39.37,65.9 37.47,63.99 34.92,63.99 34.29,64.63 20.32,64.63 17.78,62.09 R2.2
GPIO23
  Bottom 0.305: RPI1.16 36.2,70.98 36.2,69.07 36.83,68.44 37.78,68.44 38.73,67.48 38.73,66.22 37.15,64.63 35.24,64.63 34.61,65.26 20,65.26 18.73,63.99 R3.2
GPIO24  (via drill 0.5 pad 1)
  Top 0.305: v36.2,65.9 36.2,70.34 36.83,70.98 38.73,70.98 RPI1.18
  Bottom 0.305: v36.2,65.9 R4.2
GPIO25  (via drill 0.5 pad 1)
  Top 0.305: RPI1.22 46.35,70.98 46.35,65.58 48.9,63.04 48.9,55.42 50.48,53.83 v50.48,52.88
  Bottom 0.305: IC2.8 v50.48,52.88
GPIO26
  Top 0.305: J5.2 84.45,85.9 84.78,85.58 R8.1 87.94,85.58 88.27,85.9 IC4.2
  Bottom 0.305: J5.2 84.14,85.9 85.09,84.95 85.09,79.55 84.14,78.6 77.79,78.6 76.83,77.64 76.83,74.79 76.52,74.47 76.52,69.39 74.3,67.17 66.36,67.17 65.41,68.12 RPI1.37
GPIO27  (via drill 0.5 pad 1)
  Top 0.305: v34.92,91.61 36.77,91.61 SW1'.2
  Bottom 0.305: RPI1.13 33.66,70.98 33.66,74.47 33.02,75.11 33.02,89.71 v34.92,91.61
N$14
  Top 0.813: V_IN.1 75.53,9.74 73.03,12.24 66.67,12.24 65.41,13.51 60.59,13.51 V_IN'.PWR 59.05,14.14 57.78,15.41 57.78,16.98 | 57.78,16.98 D1.A | D3.C 57.78,16.98
N$16
  Top 0.305: LED1.A 6.25,55.64 6.03,55.42 LED1'.A
  Bottom 0.305: R1.1 11.11,59.55 6.99,55.42 LED1'.A
N$18
  Bottom 0.305: IC2.1 52.39,60.5 51.75,59.87 51.75,58.59 51.12,57.96 IC2.12
N$27  (via drill 0.5 pad 1)
  Top 0.813: v57.78,38.91 61.55,38.91 L3.1 | v56.2,46.53 54.29,48.44 46.35,48.44 42.86,51.93 39.05,51.93 37.15,53.83 37.15,57.96 34.92,60.18 19.37,60.18 17.89,61.66 D6.C 12.7,65.26 9.84,68.12 9.84,78.6 12.06,80.82 15.56,80.82 16.83,82.09 L2.1
  Bottom 0.813: J1.1 29.21,7.38 29.21,10.97 30.48,12.24 41.27,12.24 45.09,16.05 51.44,16.05 53.98,18.59 53.98,37.01 55.88,38.91 v57.78,38.91 56.2,40.5 v56.2,46.53
N$28  (via drill 0.5 pad 1)
  Top 0.813: v57.78,21.13 57.78,22.06 | 57.78,22.06 D2.A | D4.C 57.78,22.06
  Bottom 0.813: v57.78,21.13 62.23,21.13 63.76,19.61 V_IN'.GNDBREAK | V_IN.2 65.38,7.35 V_IN'.GNDBREAK | V_IN'.GND 60.76,5.97 V_IN'.GNDBREAK
N$29
  Bottom 0.305: IC2.5 55.24,55.42 55.88,54.78 55.88,52.88 59.05,49.7 GPS.5
N$30
  Top 0.305: LED1.C 6.25,57.74 6.03,57.96 LED1'.K
  Bottom 0.305: IC2.6 IC2.9 45.72,54.15 44.45,55.42 44.45,61.45 43.18,62.72 35.24,62.72 33.97,63.99 20.64,63.99 17.46,60.82 11.43,60.82 8.57,57.96 LED1'.K
N$31
  Bottom 0.305: IC2.3 55.24,57.96 55.88,57.33 55.88,56.05 57.78,54.15 GPS.3
N$32
  Bottom 0.305: IC2.11 IC2.4
N$33  (via drill 0.5 pad 1)
  other vias: 33.02,19.86 33.02,45.26 33.02,50.34 12.7,50.34 17.78,50.34 27.94,50.34 27.94,45.26 17.78,45.26 12.7,45.26 12.7,35.1 12.7,30.02 12.7,24.94 22.86,24.94 27.94,24.94 33.02,24.94 27.94,19.86 22.86,19.86 12.7,40.18 17.78,40.18 27.94,40.18 22.86,45.26 22.86,50.34 22.86,40.18 17.78,24.94 17.78,19.86
  pour Bottom (isolate 0.406): 10.79,21.13 13.34,18.59 33.02,18.59 34.92,20.18 34.92,52.88 32.38,55.42 14.61,55.42 10.79,51.61
  pour Top (isolate 0.406): 10.79,51.61 14.61,55.42 32.38,55.42 34.92,52.88 34.92,20.18 33.02,18.59 13.34,18.59 10.79,21.13
N$34
  Bottom 0.305: SJ2.2 66.99,47.48 66.67,47.16 62.23,47.16 61.59,47.8 61.59,50.34 60.33,51.61 GPS.4
N$35
  Bottom 0.305: IC2.2 55.24,59.23 56.52,57.96 56.52,56.37 57.47,55.42 62.23,55.42 63.18,54.47 63.18,52.56 65.47,50.28 SJ2.1
N$36  (via drill 0.5 pad 1)
  Top 0.406: v38.16,30.85 40.12,30.85 D5.C
  Top 1.27: 52.7,41.9 51.44,40.62 v51.44,39.55 | v51.44,39.55 v51.44,38.59 50.48,37.64 41.91,37.64 40.12,35.84 D5.C | v51.44,39.55 50.16,40.81 | v51.44,39.55 52.39,40.5
  Top 1.422: IC1.2 39.91,30.86 D5.C | 52.7,41.9 L1.1
  Bottom 0.406: v37.08,30.85 v38.16,30.85
  Bottom 1.27: v38.16,30.85 40.13,32.81 40.13,35.86 41.91,37.64 50.48,37.64 v51.44,38.59 v51.44,39.55
  Bottom 1.422: IC1.2 38.04,30.86 38.04,30.85
N$37  (via drill 0.5 pad 1)
  Top 0.305: v69.85,54.15 68.26,54.15 67.63,54.78 67.63,64.31 65.72,66.22 54.61,66.22 53.02,64.63 53.02,51.61 51.75,50.34 49.21,50.34 47.94,51.61 47.94,53.52 46.99,54.47 46.99,57.33 46.35,57.96 BT01.1
  Bottom 0.305: v69.85,54.15 70.48,54.78 70.48,55.42 71.75,56.69 IC3.3
N$38
  Bottom 0.305: IC3.2 75.56,57.96 76.52,58.91 76.52,63.67 75.88,64.31 Y01.X1
N$39
  Bottom 0.305: IC3.1 73.03,59.23 73.66,59.87 Y01.X2
N$40  (via drill 0.5 pad 1)
  Top 0.305: R5.1 v13.97,78.28 | LED5.A 6.25,75.96 6.03,75.74 LED5'.A
  Bottom 0.305: v13.97,78.28 12.7,78.28 12.06,77.64 12.06,76.38 11.43,75.74 LED5'.A
N$41
  Top 0.305: LED3.A 6.25,65.8 6.03,65.58 LED3'.A
  Bottom 0.305: R3.1 11.75,63.99 10.16,65.58 LED3'.A
N$43
  Top 0.305: LED4.A 6.25,70.88 6.03,70.66 LED4'.A
  Bottom 0.305: R4.1 10.79,65.9 10.48,66.22 9.53,66.22 8.89,66.85 8.89,69.39 7.62,70.66 LED4'.A
N$44  (via drill 0.5 pad 1)
  Top 0.305: v63.5,64.94 64.45,63.99 v64.45,54.15
  Bottom 0.305: Q1.3 55.56,65.58 56.2,66.22 62.23,66.22 v63.5,64.94 | R7.1 v64.45,54.15 64.45,52.24 66.61,50.09 67.94,50.09 68.52,49.51 SJ2.3
N$45
  Top 0.305: LED2.A 6.25,60.72 6.03,60.5 LED2'.A
  Bottom 0.305: R2.1 11.75,62.09 10.16,60.5 LED2'.A
RXD  (via drill 0.5 pad 1)
  Top 0.305: RPI1.10 31.11,70.98 31.11,68.75 30.16,67.8 30.16,63.67 31.11,62.72 46.99,62.72 48.26,61.45 48.26,55.1 49.21,54.15 49.21,52.24 49.85,51.61 51.12,51.61 51.75,52.24 51.75,54.47 50.8,55.42 v50.48,55.42
  Bottom 0.305: IC2.10 v50.48,55.42
SCL  (via drill 0.5 pad 1)
  Top 0.305: RPI1.5 24.77,70.34 26.04,71.61 26.04,73.2 25.08,74.15 25.08,78.92 26.04,79.87 43.18,79.87 44.45,81.14 44.45,86.85 45.4,87.81 68.58,87.81 JP2.3 | v69.85,56.69 70.8,56.69 73.66,59.55 73.66,65.58 77.15,69.07 77.15,74.15 77.47,74.47 v77.47,82.09 77.47,84 76.83,84.63 75.88,85.58 75.88,86.85 JP3.3
  Bottom 0.305: IC3.6 v69.85,56.69 | JP2.3 71.12,85.9 73.66,88.44 JP3.3
SDA  (via drill 0.5 pad 1)
  Top 0.305: RPI1.3 22.23,70.34 23.5,71.61 23.5,73.2 24.45,74.15 24.45,79.23 25.72,80.5 42.86,80.5 43.81,81.45 43.81,87.17 45.09,88.44 JP2.4 | v68.9,55.42 70.48,55.42 74.3,59.23 74.3,65.26 77.79,68.75 77.79,73.83 78.11,74.15 78.11,81.14 v79.06,82.09 78.11,83.04 78.11,84.63 76.83,85.9 76.83,87.17 76.2,87.81 75.88,88.12 75.88,89.39 75.25,90.03 74.93,90.34 JP3.2
  Bottom 0.305: IC3.5 v68.9,55.42 | JP2.4 71.12,88.44 73.66,90.98 JP3.2
SPI_CE0
  Top 0.305: JP7.17 34.29,77.64 35.24,78.6 42.55,78.6 43.18,77.96 43.18,76.38 47.31,72.25 RPI1.24
SPI_MISO
  Top 0.305: RPI1.21 43.81,70.98 43.81,73.2 41.91,75.11 41.27,75.11 JP7.15
SPI_MOSI
  Top 0.305: RPI1.19 41.27,70.98 41.27,73.2 40.01,74.47 39.37,74.47 JP7.16
SPI_SCLK
  Bottom 0.305: RPI1.23 46.35,70.98 46.35,73.2 43.18,76.38 42.55,76.38 JP7.14
SX_RST
  Top 0.305: JP7.13 44.45,77.96 43.18,79.23 34.61,79.23 33.02,77.64 33.02,75.11 33.66,74.47 33.66,71.61 32.38,70.34 RPI1.11
TXD  (via drill 0.5 pad 1)  (1 unrouted)
  Top 0.305: RPI1.8 28.57,70.98 28.57,68.75 29.53,67.8 29.53,63.36 30.8,62.09 46.67,62.09 47.62,61.14 47.62,54.78 48.58,53.83 48.58,51.93 49.53,50.98 51.44,50.98 52.39,51.93 52.39,58.28 51.44,59.23 v50.48,59.23 50.48,65.26 49.21,66.53 v47.94,66.53
  Bottom 0.305: Q1.2 R6.1 51.12,66.53 | v50.48,59.23 IC2.13 | R6.1 v47.95,66.53 v47.94,66.53
V_IN
  Top 0.813: D2.C D1.C | C1.+ 43.86,8.89 C1'.+ 36.83,22.4 38.1,23.67 | IC1.1 35.07,26.7 38.1,23.67 | 38.1,23.67 D2.C | DC/DC.VIN-1 DC/DC.VIN-2 51.77,25.74 D2.C
V_REG  (via drill 0.5 pad 1)
  Top 0.813: v29.84,42.09 12.06,42.09 | D6.A 12.7,53.2 10.62,51.12 C2.+ 10.62,43.53 12.06,42.09 | C3.+ 10.62,40.64 12.06,42.09
  Top 1.27: L1.2 44.32,42.09 DC/DC.VOUT-1 DC/DC.VOUT-2
  Top 1.422: v31.11,42.09 L1.2 | IC1.4 32.91,34.26 32.07,35.1 32.07,41.13 v31.11,42.09 | v31.11,42.09 v29.84,42.09
  Bottom 1.422: IC1.4 32.91,34.26 32.07,35.1 32.07,41.13 v31.11,42.09 v29.84,42.09

### Text on the board
tPlace: NC | GND | NC | SDA | GND | Shutdown / Gateway | SDA | SCL | NC | SCL | +5V | DAT | GND | 3V3 | 3V3 | Shared Power / PI & iC880A | 3V3 | DS18x20 | I2C | PWR | BMx280 | + | INFO3 | + | INFO2 | + | CR1225 | INFO1 | + | Serial | +5V | +5V | PPS | GND | GND | + | in | TXD | out | RXD | GPS | #25 | PPS | GND | +5V | LM2576 max 40V / LM2576HV max 60V | GND | VIN | RPI-Lora-GW / V1.1 2018/01 | Antenna Fix | github.com/XantaroDE / <randy@xantaro.net> / based on ch2i.eu | GND | VIN | GND | VIN | DC Input / max 30V/50V | 5V | DC Barel
bPlace: NC | GND | NC | SDA | GND | SDA | SCL | NC | SCL | +5V | DAT | GND | 3V3 | 3V3 | 3V3 | DS18x20 | DHTxx | I2C | BMx280 | GND | +5V | 5V 3V / Serial | DC/DC / Step Down | GND | VIN | RPI-Lora-GW / V1.1 2018/01 | Antenna Fix | github.com/XantaroDE / <randy@xantaro.net> / based on ch2i.eu | GND | VIN | GND | VIN | DC Input / max 30 50V | 5V